# Altium schematic sheet Bank-2.SchDoc
size A3; SheetNumber: 2; SheetTotal: 8
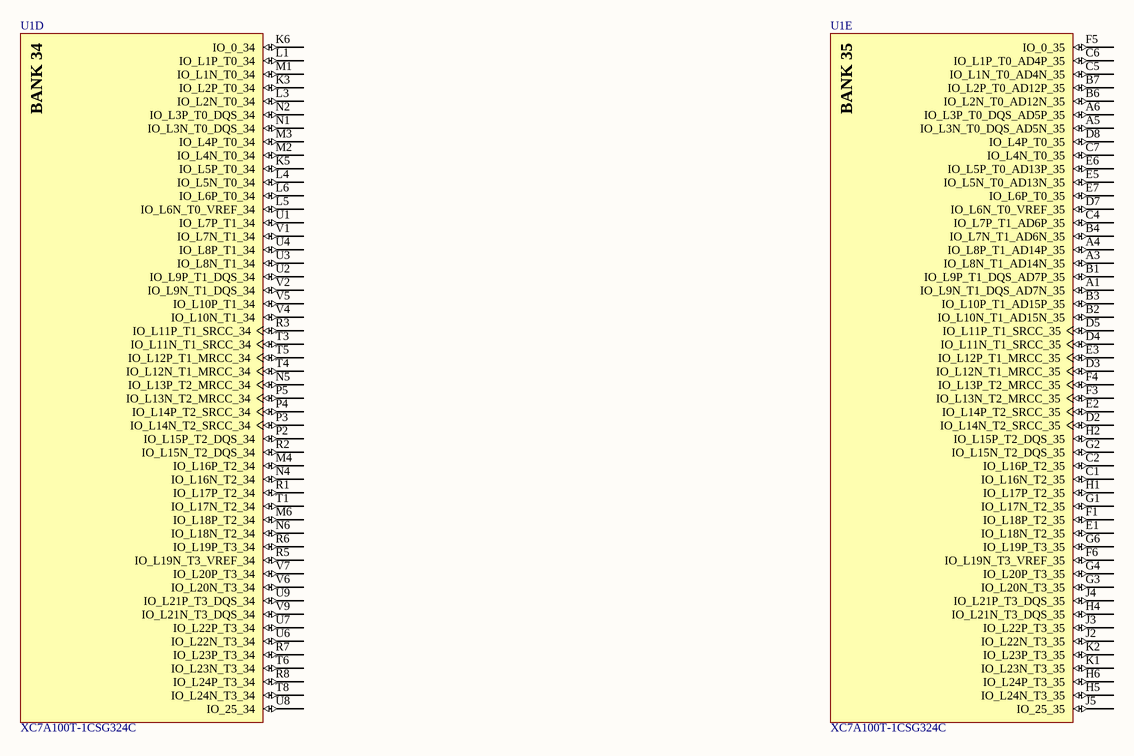
[diagram p0: Bank-2.SchDoc]

## Parts
U1  XC7A100T-1CSG324C  [CSG324]  (parts D,E of 9)

## Nets

Not connected (* = marked no-connect by the designer): U1 A1(IO_L9N_T1_DQS_AD7N_35) A3(IO_L8N_T1_AD14N_35) A4(IO_L8P_T1_AD14P_35) A5(IO_L3N_T0_DQS_AD5N_35) A6(IO_L3P_T0_DQS_AD5P_35) B1(IO_L9P_T1_DQS_AD7P_35) B2(IO_L10N_T1_AD15N_35) B3(IO_L10P_T1_AD15P_35) B4(IO_L7N_T1_AD6N_35) B6(IO_L2N_T0_AD12N_35) B7(IO_L2P_T0_AD12P_35) C1(IO_L16N_T2_35) C2(IO_L16P_T2_35) C4(IO_L7P_T1_AD6P_35) C5(IO_L1N_T0_AD4N_35) C6(IO_L1P_T0_AD4P_35) C7(IO_L4N_T0_35) D2(IO_L14N_T2_SRCC_35) D3(IO_L12N_T1_MRCC_35) D4(IO_L11N_T1_SRCC_35) D5(IO_L11P_T1_SRCC_35) D7(IO_L6N_T0_VREF_35) D8(IO_L4P_T0_35) E1(IO_L18N_T2_35) E2(IO_L14P_T2_SRCC_35) E3(IO_L12P_T1_MRCC_35) E5(IO_L5N_T0_AD13N_35) E6(IO_L5P_T0_AD13P_35) E7(IO_L6P_T0_35) F1(IO_L18P_T2_35) F3(IO_L13N_T2_MRCC_35) F4(IO_L13P_T2_MRCC_35) F5(IO_0_35) F6(IO_L19N_T3_VREF_35) G1(IO_L17N_T2_35) G2(IO_L15N_T2_DQS_35) G3(IO_L20N_T3_35) G4(IO_L20P_T3_35) G6(IO_L19P_T3_35) H1(IO_L17P_T2_35) H2(IO_L15P_T2_DQS_35) H4(IO_L21N_T3_DQS_35) H5(IO_L24N_T3_35) H6(IO_L24P_T3_35) J2(IO_L22N_T3_35) J3(IO_L22P_T3_35) J4(IO_L21P_T3_DQS_35) J5(IO_25_35) K1(IO_L23N_T3_35) K2(IO_L23P_T3_35) K3(IO_L2P_T0_34) K5(IO_L5P_T0_34) K6(IO_0_34) L1(IO_L1P_T0_34) L3(IO_L2N_T0_34) L4(IO_L5N_T0_34) L5(IO_L6N_T0_VREF_34) L6(IO_L6P_T0_34) M1(IO_L1N_T0_34) M2(IO_L4N_T0_34) M3(IO_L4P_T0_34) M4(IO_L16P_T2_34) M6(IO_L18P_T2_34) N1(IO_L3N_T0_DQS_34) N2(IO_L3P_T0_DQS_34) N4(IO_L16N_T2_34) N5(IO_L13P_T2_MRCC_34) N6(IO_L18N_T2_34) P2(IO_L15P_T2_DQS_34) P3(IO_L14N_T2_SRCC_34) P4(IO_L14P_T2_SRCC_34) P5(IO_L13N_T2_MRCC_34) R1(IO_L17P_T2_34) R2(IO_L15N_T2_DQS_34) R3(IO_L11P_T1_SRCC_34) R5(IO_L19N_T3_VREF_34) R6(IO_L19P_T3_34) R7(IO_L23P_T3_34) R8(IO_L24P_T3_34) T1(IO_L17N_T2_34) T3(IO_L11N_T1_SRCC_34) T4(IO_L12N_T1_MRCC_34) T5(IO_L12P_T1_MRCC_34) T6(IO_L23N_T3_34) T8(IO_L24N_T3_34) U1(IO_L7P_T1_34) U2(IO_L9P_T1_DQS_34) U3(IO_L8N_T1_34) U4(IO_L8P_T1_34) U6(IO_L22N_T3_34) U7(IO_L22P_T3_34) U8(IO_25_34) U9(IO_L21P_T3_DQS_34) V1(IO_L7N_T1_34) V2(IO_L9N_T1_DQS_34) V4(IO_L10N_T1_34) V5(IO_L10P_T1_34) V6(IO_L20N_T3_34) V7(IO_L20P_T3_34) V9(IO_L21N_T3_DQS_34)

## Notes on the sheet
- (in symbol CMP-016-00010-1, part D) BANK 34
- (in symbol CMP-016-00010-1, part E) BANK 35

## Library data of the parts
U1 = CMP-016-00010-1: Field Programmable Gate Array, 7925 CLBs, 1098MHz, 101440-Cell, PBGA324; Nominal Supply Voltage: 1V; Package Body Material: Plastic; Min Supply Voltage: 950mV; Max Supply Voltage: 1.05V; Number of Outputs: 210; Number of Logic Elements/Cells: 101440; Clock Frequency: 1.098GHz; Qualification Status: Not Qualified; Number of CLBs: 7925; Combinatorial Delay of a CLB-Max: 1.27ns; Terminal Finish: Copper; Moisture Sensitivity Level: 3; Terminal Position: BOTTOM; Max Operating Temperature: 85°C; Pins: 324; Case/Package: LFBGA; Number of Inputs: 210; Power Supplies: 1V; Height - Seated (Max): 1.5mm; Surface Mount: Yes; Package Style: GRID ARRAY, LOW PROFILE, FINE PITCHMeter; JESD-609 Code: e1; Reach SVHC Compliant: Yes; Programmable Logic Type: FIELD PROGRAMMABLE GATE ARRAY; Terminal Pitch: 0.8mm; Package Shape: Square; Width: 15mm; Terminal Form: Ball; Length: 15mm; RoHS Compliant: Yes; Temperature Grade: OTHER; Technology: CMOS; Min Operating Temperature: 0°C